# Altium schematic sheet CADDX.SchDoc
size Letter
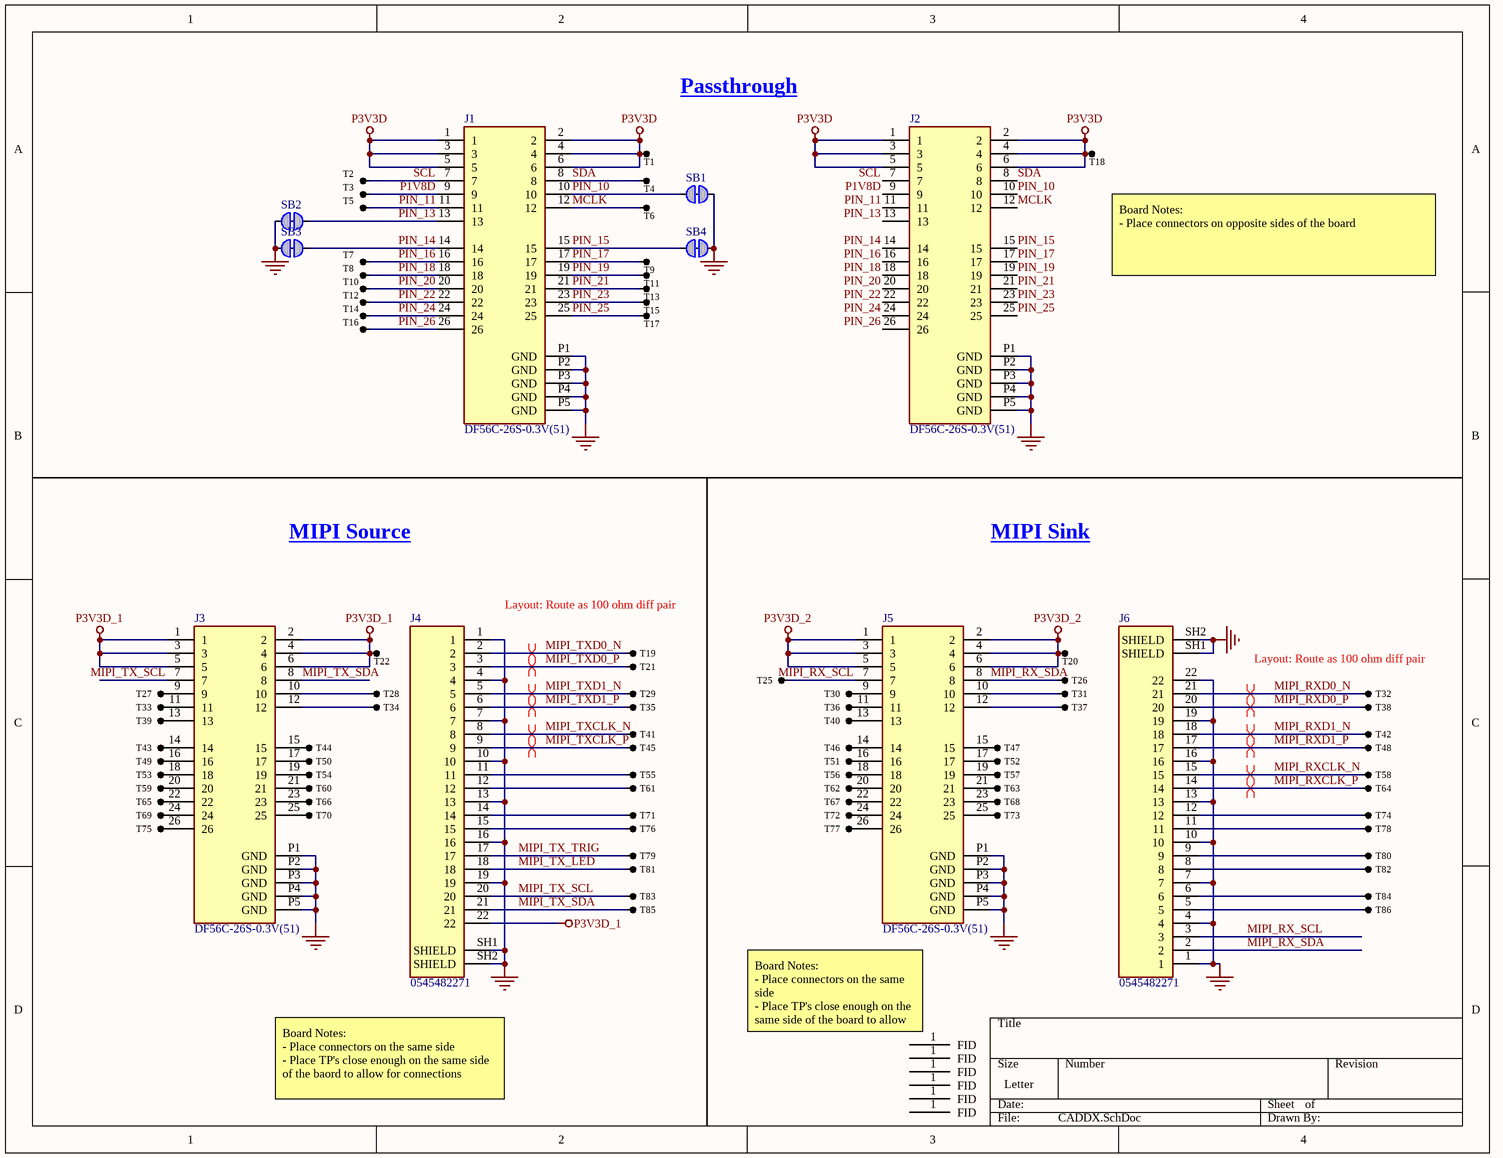
[diagram p0: CADDX.SchDoc]

## Parts
FID1  FID  [FID_040]  (value not drawn)  (no BOM)
FID2  FID  [FID_040]  (value not drawn)  (no BOM)
FID3  FID  [FID_040]  (value not drawn)  (no BOM)
FID4  FID  [FID_040]  (value not drawn)  (no BOM)
FID5  FID  [FID_040]  (value not drawn)  (no BOM)
FID6  FID  [FID_040]  (value not drawn)  (no BOM)
J1  DF56C-26S-0.3V(51)  [HRS_DF56C-26S-0.3V(51)]
J2  DF56C-26S-0.3V(51)  [HRS_DF56C-26S-0.3V(51)]
J3  DF56C-26S-0.3V(51)  [HRS_DF56C-26S-0.3V(51)]
J4  0545482271  [MOLEX_54548-2271]
J5  DF56C-26S-0.3V(51)  [HRS_DF56C-26S-0.3V(51)]
J6  0545482271  [MOLEX_54548-2271]
SB1  Solderbridge  [Solderbridge_Shorted]  (value not drawn)  (net tie, no BOM)
SB2  Solderbridge  [Solderbridge_Shorted]  (value not drawn)  (net tie, no BOM)
SB3  Solderbridge  [Solderbridge_Shorted]  (value not drawn)  (net tie, no BOM)
SB4  Solderbridge  [Solderbridge_Shorted]  (value not drawn)  (net tie, no BOM)
T1  (no value)  [TP 1mm]  (no BOM)
T2  (no value)  [TP 1mm]  (no BOM)
T3  (no value)  [TP 1mm]  (no BOM)
T4  (no value)  [TP 1mm]  (no BOM)
T5  (no value)  [TP 1mm]  (no BOM)
T6  (no value)  [TP 1mm]  (no BOM)
T7  (no value)  [TP 1mm]  (no BOM)
T8  (no value)  [TP 1mm]  (no BOM)
T9  (no value)  [TP 1mm]  (no BOM)
T10  (no value)  [TP 1mm]  (no BOM)
T11  (no value)  [TP 1mm]  (no BOM)
T12  (no value)  [TP 1mm]  (no BOM)
T13  (no value)  [TP 1mm]  (no BOM)
T14  (no value)  [TP 1mm]  (no BOM)
T15  (no value)  [TP 1mm]  (no BOM)
T16  (no value)  [TP 1mm]  (no BOM)
T17  (no value)  [TP 1mm]  (no BOM)
T18  (no value)  [TP 1mm]  (no BOM)
T19  (no value)  [TP 1mm]  (no BOM)
T20  (no value)  [TP 1mm]  (no BOM)
T21  (no value)  [TP 1mm]  (no BOM)
T22  (no value)  [TP 1mm]  (no BOM)
T25  (no value)  [TP 1mm]  (no BOM)
T26  (no value)  [TP 1mm]  (no BOM)
T27  (no value)  [TP 1mm]  (no BOM)
T28  (no value)  [TP 1mm]  (no BOM)
T29  (no value)  [TP 1mm]  (no BOM)
T30  (no value)  [TP 1mm]  (no BOM)
T31  (no value)  [TP 1mm]  (no BOM)
T32  (no value)  [TP 1mm]  (no BOM)
T33  (no value)  [TP 1mm]  (no BOM)
T34  (no value)  [TP 1mm]  (no BOM)
T35  (no value)  [TP 1mm]  (no BOM)
T36  (no value)  [TP 1mm]  (no BOM)
T37  (no value)  [TP 1mm]  (no BOM)
T38  (no value)  [TP 1mm]  (no BOM)
T39  (no value)  [TP 1mm]  (no BOM)
T40  (no value)  [TP 1mm]  (no BOM)
T41  (no value)  [TP 1mm]  (no BOM)
T42  (no value)  [TP 1mm]  (no BOM)
T43  (no value)  [TP 1mm]  (no BOM)
T44  (no value)  [TP 1mm]  (no BOM)
T45  (no value)  [TP 1mm]  (no BOM)
T46  (no value)  [TP 1mm]  (no BOM)
T47  (no value)  [TP 1mm]  (no BOM)
T48  (no value)  [TP 1mm]  (no BOM)
T49  (no value)  [TP 1mm]  (no BOM)
T50  (no value)  [TP 1mm]  (no BOM)
T51  (no value)  [TP 1mm]  (no BOM)
T52  (no value)  [TP 1mm]  (no BOM)
T53  (no value)  [TP 1mm]  (no BOM)
T54  (no value)  [TP 1mm]  (no BOM)
T55  (no value)  [TP 1mm]  (no BOM)
T56  (no value)  [TP 1mm]  (no BOM)
T57  (no value)  [TP 1mm]  (no BOM)
T58  (no value)  [TP 1mm]  (no BOM)
T59  (no value)  [TP 1mm]  (no BOM)
T60  (no value)  [TP 1mm]  (no BOM)
T61  (no value)  [TP 1mm]  (no BOM)
T62  (no value)  [TP 1mm]  (no BOM)
T63  (no value)  [TP 1mm]  (no BOM)
T64  (no value)  [TP 1mm]  (no BOM)
T65  (no value)  [TP 1mm]  (no BOM)
T66  (no value)  [TP 1mm]  (no BOM)
T67  (no value)  [TP 1mm]  (no BOM)
T68  (no value)  [TP 1mm]  (no BOM)
T69  (no value)  [TP 1mm]  (no BOM)
T70  (no value)  [TP 1mm]  (no BOM)
T71  (no value)  [TP 1mm]  (no BOM)
T72  (no value)  [TP 1mm]  (no BOM)
T73  (no value)  [TP 1mm]  (no BOM)
T74  (no value)  [TP 1mm]  (no BOM)
T75  (no value)  [TP 1mm]  (no BOM)
T76  (no value)  [TP 1mm]  (no BOM)
T77  (no value)  [TP 1mm]  (no BOM)
T78  (no value)  [TP 1mm]  (no BOM)
T79  (no value)  [TP 1mm]  (no BOM)
T80  (no value)  [TP 1mm]  (no BOM)
T81  (no value)  [TP 1mm]  (no BOM)
T82  (no value)  [TP 1mm]  (no BOM)
T83  (no value)  [TP 1mm]  (no BOM)
T84  (no value)  [TP 1mm]  (no BOM)
T85  (no value)  [TP 1mm]  (no BOM)
T86  (no value)  [TP 1mm]  (no BOM)

## Nets
GND: J1.P1(GND) J1.P2(GND) J1.P3(GND) J1.P4(GND) J1.P5(GND) J2.P1(GND) J2.P2(GND) J2.P3(GND) J2.P4(GND) J2.P5(GND) J3.P1(GND) J3.P2(GND) J3.P3(GND) J3.P4(GND) J3.P5(GND) J4.1 J4.4 J4.7 J4.10 J4.13 J4.16 J4.19 J4.SH1(SHIELD) J4.SH2(SHIELD) J5.P1(GND) J5.P2(GND) J5.P3(GND) J5.P4(GND) J5.P5(GND) J6.1 J6.4 J6.7 J6.10 J6.13 J6.16 J6.19 J6.22 J6.SH1(SHIELD) J6.SH2(SHIELD) SB1.1 SB2.2 SB3.2 SB4.1
P3V3D: J1.1 J1.2 J1.3 J1.4 J1.5 J1.6 J2.1 J2.2 J2.3 J2.4 J2.5 J2.6 T1.1 T18.1
P3V3D_1: J3.1 J3.2 J3.3 J3.4 J3.5 J3.6 J4.22 T22.1
P3V3D_2: J5.1 J5.2 J5.3 J5.4 J5.5 J5.6 T20.1
MCLK: J1.12 J2.12 T6.1
MIPI_RX_SCL: J5.7 J6.3 T25.1
MIPI_RX_SDA: J5.8 J6.2 T26.1
MIPI_RXCLK_N: J6.15 T58.1
MIPI_RXCLK_P: J6.14 T64.1
MIPI_RXD0_N: J6.21 T32.1
MIPI_RXD0_P: J6.20 T38.1
MIPI_RXD1_N: J6.18 T42.1
MIPI_RXD1_P: J6.17 T48.1
MIPI_TX_LED: J4.18 T81.1
MIPI_TX_SCL: J3.7 J4.20 T83.1
MIPI_TX_SDA: J3.8 J4.21 T85.1
MIPI_TX_TRIG: J4.17 T79.1
MIPI_TXCLK_N: J4.8 T41.1
MIPI_TXCLK_P: J4.9 T45.1
MIPI_TXD0_N: J4.2 T19.1
MIPI_TXD0_P: J4.3 T21.1
MIPI_TXD1_N: J4.5 T29.1
MIPI_TXD1_P: J4.6 T35.1
P1V8D: J1.9 J2.9 T3.1
PIN_10: J1.10 J2.10 SB1.2
PIN_11: J1.11 J2.11 T5.1
PIN_13: J1.13 J2.13 SB2.1
PIN_14: J1.14 J2.14 SB3.1
PIN_15: J1.15 J2.15 SB4.2
PIN_16: J1.16 J2.16 T7.1
PIN_17: J1.17 J2.17 T9.1
PIN_18: J1.18 J2.18 T8.1
PIN_19: J1.19 J2.19 T11.1
PIN_20: J1.20 J2.20 T10.1
PIN_21: J1.21 J2.21 T13.1
PIN_22: J1.22 J2.22 T12.1
PIN_23: J1.23 J2.23 T15.1
PIN_24: J1.24 J2.24 T14.1
PIN_25: J1.25 J2.25 T17.1
PIN_26: J1.26 J2.26 T16.1
SCL: J1.7 J2.7 T2.1
SDA: J1.8 J2.8 T4.1
NetJ3_9: J3.9 T27.1
NetJ3_10: J3.10 T28.1
NetJ3_11: J3.11 T33.1
NetJ3_12: J3.12 T34.1
NetJ3_13: J3.13 T39.1
NetJ3_14: J3.14 T43.1
NetJ3_15: J3.15 T44.1
NetJ3_16: J3.16 T49.1
NetJ3_17: J3.17 T50.1
NetJ3_18: J3.18 T53.1
NetJ3_19: J3.19 T54.1
NetJ3_20: J3.20 T59.1
NetJ3_21: J3.21 T60.1
NetJ3_22: J3.22 T65.1
NetJ3_23: J3.23 T66.1
NetJ3_24: J3.24 T69.1
NetJ3_25: J3.25 T70.1
NetJ3_26: J3.26 T75.1
NetJ4_11: J4.11 T55.1
NetJ4_12: J4.12 T61.1
NetJ4_14: J4.14 T71.1
NetJ4_15: J4.15 T76.1
NetJ5_9: J5.9 T30.1
NetJ5_10: J5.10 T31.1
NetJ5_11: J5.11 T36.1
NetJ5_12: J5.12 T37.1
NetJ5_13: J5.13 T40.1
NetJ5_14: J5.14 T46.1
NetJ5_15: J5.15 T47.1
NetJ5_16: J5.16 T51.1
NetJ5_17: J5.17 T52.1
NetJ5_18: J5.18 T56.1
NetJ5_19: J5.19 T57.1
NetJ5_20: J5.20 T62.1
NetJ5_21: J5.21 T63.1
NetJ5_22: J5.22 T67.1
NetJ5_23: J5.23 T68.1
NetJ5_24: J5.24 T72.1
NetJ5_25: J5.25 T73.1
NetJ5_26: J5.26 T77.1
NetJ6_5: J6.5 T86.1
NetJ6_6: J6.6 T84.1
NetJ6_8: J6.8 T82.1
NetJ6_9: J6.9 T80.1
NetJ6_11: J6.11 T78.1
NetJ6_12: J6.12 T74.1

Not connected (* = marked no-connect by the designer): FID1 1(FID); FID2 1(FID); FID3 1(FID); FID4 1(FID); FID5 1(FID); FID6 1(FID)

## Layout directives
differential pair: MIPI_RXCLK_N, MIPI_RXCLK_P, MIPI_RXD0_N, MIPI_RXD0_P, MIPI_RXD1_N, MIPI_RXD1_P, MIPI_TXCLK_N, MIPI_TXCLK_P, MIPI_TXD0_N, MIPI_TXD0_P, MIPI_TXD1_N, MIPI_TXD1_P

## Notes on the sheet
- Passthrough
- (near T18) Board Notes:
  - Place connectors on opposite sides of the board
- MIPI Source
- MIPI Sink
- Layout: Route as 100 ohm diff pair
- Board Notes:
  - Place connectors on the same side
  - Place TP's close enough on the same side of the board to allow for connections
- Board Notes:
  - Place connectors on the same side
  - Place TP's close enough on the same side of the baord to allow for connections

## Library data of the parts
FID1-FID6 = FID: Notes: DNP
J1-J3 J5 = DF56C-26S-0.3V(51): 0.3mm Pitch, Vertical Mating, Board-to-Fine Coaxial Cable, -35 ℃ to 85 ℃, RoHS; Manufacturer: Hirose; Number of Positions: 26; Connector Type: Receptacle; Voltage Rating (AC): 30V; Supplier: Digi-Key; Supplier Part Number: 26-DF56C-26S-0.3V(51)DKR-ND; Manufacturer Part Number: DF56C-26S-0.3V(51); RoHS: Yes; Category: Headers and Wire Housings; Pricing: 1=1.42000, 10=1.23400, 25=1.18160, 50=1.15540, 100=1.10290, 250=0.99788, 500=0.91910, 1000=0.78780, 2500=0.73528 (USD); Mounting Technology: Surface Mount; Contact Material: Bronze; Contact Finish - Mating: GOLD; Insulation Color: Black; Insulation Material: Polymer; Min Operating Temperature: -35°C; Max Operating Temperature: 85°C; Package Quantity: 5000; Packaging: Tape and Reel; Series: DF56; Number of Rows: 1; Fastening Type: Friction; Contact Type: Non-Gendered; Termination: Solder; RoHS Compliant: Yes; Flammability Rating: UL94 V-0; ComponentLink1URL: http://www.mouser.com/ds/2/185/DF56_catalog-939255.pdf?src-supplier=Mouser; ComponentLink1Description: http://www.mouser.com/ds/2/185/DF56_catalog-939255.pdf?src-supplier=Mouser; ComponentLink2URL: https://www.hirose.com/product/document?clcode=CL0662-5607-0-51&amp;productname=DF56-50P-0.3SD(51)&amp;series=DF56&amp;documenttype=Catalog&amp;lang=en&amp;documentid=D49344_en&src-supplier=Digi-Key; ComponentLink2Description: https://www.hirose.com/product/document?clcode=CL0662-5607-0-51&amp;productname=DF56-50P-0.3SD(51)&amp;series=DF56&amp;documenttype=Catalog&amp;lang=en&amp;documentid=D49344_en&src-supplier=Digi-Key
J4 J6 = 54548-2271: CONN FFC BOTTOM 22POS 0.50MM R/A; Manufacturer: Molex; Manufacturer Part Number: 0545482271; Supplier Part Number: WM8828CT-ND; Package: None; Supplier: Digi-Key; Value: *
SB1-SB4 = Solderbridge Shorted: Shorted Solderbridge; Artikkelnr Noca: N.A.; Part Number: Solderbridge Shorted; Manufacturer: *; Manufacturer Part Number: *; Datasheet: *; LatestRevisionDate: 2012-08-07; Pin Count: 2; Publisher: Nordic Semiconductor; Published: 2012-08-07; Value: Solderbridge; Note: *; Supplier: *; Supplier part number: *; 2nd source Supplier: *; 2nd source part number: *; Footprint Doc: Solderbridge_Shorted; Artikkelnr Simpro: N.A.
T1-T22 T25-T86 = TP_S: test point